# Altium schematic sheet Controle.SchDoc
size A4; Engineer: Kayann Soares; SheetNumber: 2; SheetTotal: 11; CompanyInfo1: Universidade Federal do Ceará; CompanyInfo2: Centro de Tecnologia - CT; CompanyInfo3: Dep. de Eng. de Teleinformática
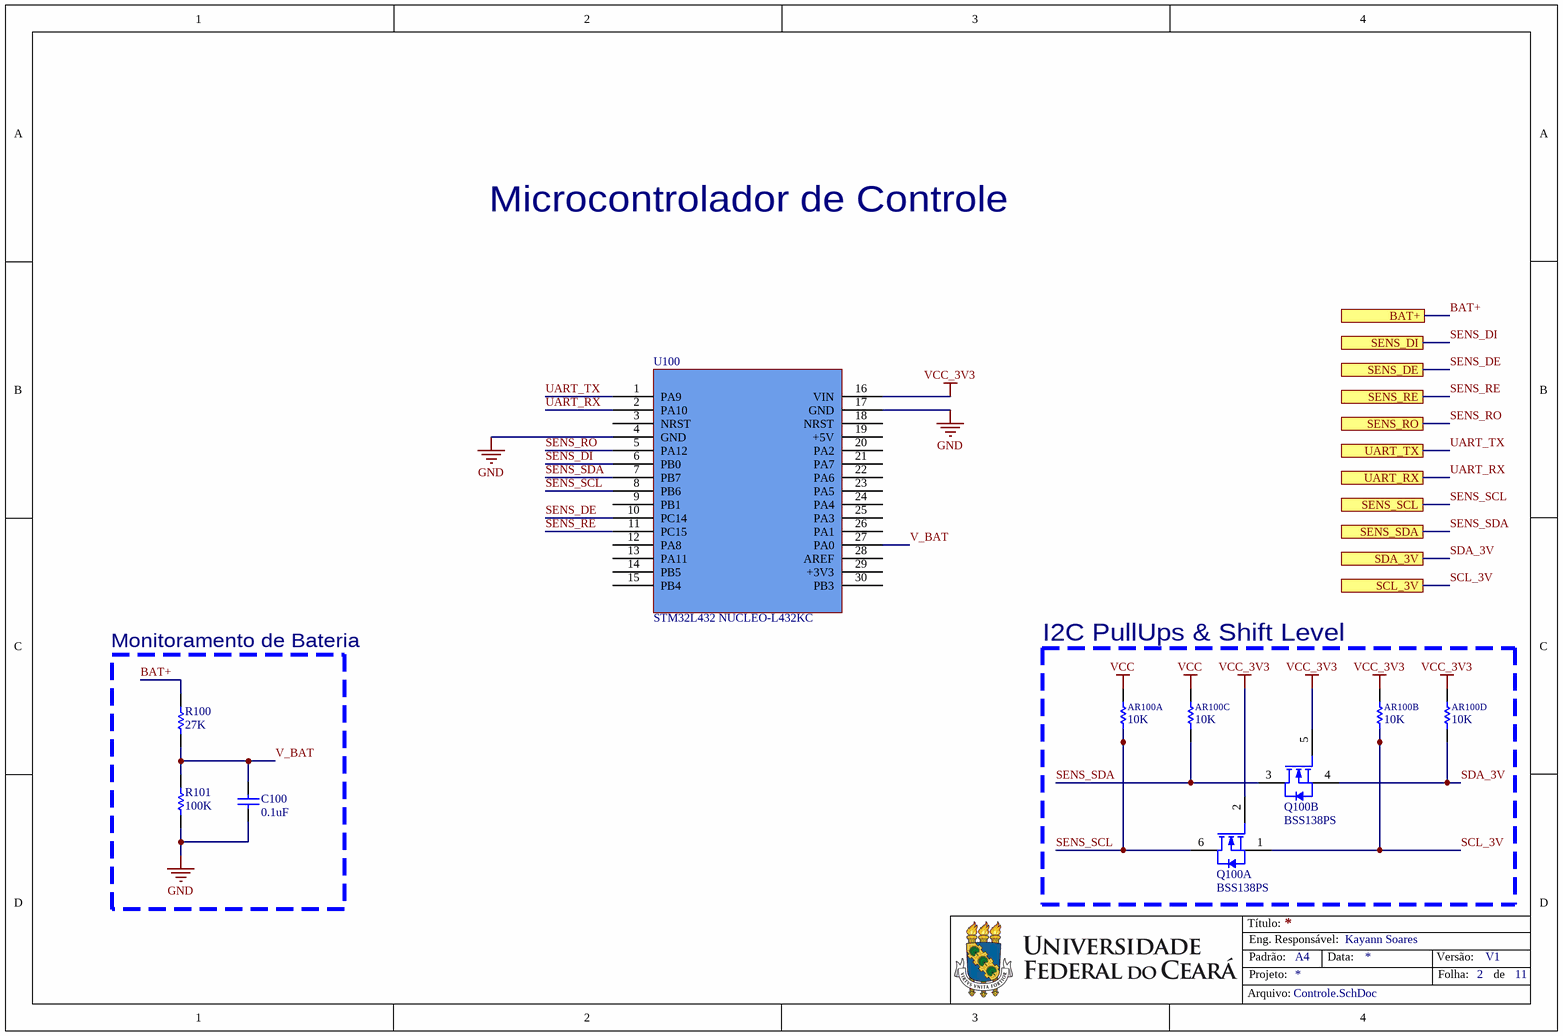
[diagram p0: Controle.SchDoc]

## Parts
AR100  10K  [RES_ARRAY _4RES_1206]  (parts A,B,C,D of 4)
C100  0.1uF  [CAP_CER_0603]
Q100  BSS138PS  [BSS138PS]  (parts A,B of 2)
R100  27K  [RES_0603]
R101  100K  [RES_0603]
U100  STM32L432 NUCLEO-L432KC  [STM32L432]

## Blocks framed on the sheet
Monitoramento de Bateria: C100 R100 R101
I2C PullUps & Shift Level: AR100 Q100

## Ports
BAT+, SCL_3V, SDA_3V, SENS_DE, SENS_DI, SENS_RE, SENS_RO, SENS_SCL, SENS_SDA, UART_RX, UART_TX

## Nets
GND: C100.1 R101.1 U100.4(GND) U100.17(GND)
VCC: AR100.6 AR100.8
VCC_3V3: AR100.5 AR100.7 Q100.2(G1) Q100.5(G2) U100.16(VIN)
BAT+: R100.2 ; port BAT+
SCL_3V: AR100.2 Q100.1(S1) ; port SCL_3V
SDA_3V: AR100.4 Q100.4(S2) ; port SDA_3V
SENS_DE: U100.10(PC14) ; port SENS_DE
SENS_DI: U100.6(PB0) ; port SENS_DI
SENS_RE: U100.11(PC15) ; port SENS_RE
SENS_RO: U100.5(PA12) ; port SENS_RO
SENS_SCL: AR100.1 Q100.6(D1) U100.8(PB6) ; port SENS_SCL
SENS_SDA: AR100.3 Q100.3(D2) U100.7(PB7) ; port SENS_SDA
UART_RX: U100.2(PA10) ; port UART_RX
UART_TX: U100.1(PA9) ; port UART_TX
V_BAT: C100.2 R100.1 R101.2 U100.27(PA0)

Not connected (* = marked no-connect by the designer): U100 3(NRST) 9(PB1) 12(PA8) 13(PA11) 14(PB5) 15(PB4) 18(NRST) 19(+5V) 20(PA2) 21(PA7) 22(PA6) 23(PA5) 24(PA4) 25(PA3) 26(PA1) 28(AREF) 29(+3V3) 30(PB3)

## Notes on the sheet
- Microcontrolador de Controle
- Título:
- Padrão:
- Projeto:
- Eng. Responsável:
- A4
- Data:
- Versão:
- Folha:
- V1
- de
- Arquivo:

## Library data of the parts
AR100 = RES_ARRAY_10K_1206: Supplier 1: Arrow Electronics; Supplier Part Number 1: CAY16-103J4LF
C100 = CAP_CER_0.1uF_0603: Supplier 1: Digi-Key Marketplace; Supplier Part Number 1: 2571-GMC10X7R104J25NTTR-ND
R100 = RES_27K_0603: Supplier 1: Future Electronics; Supplier Part Number 1: 6067715
R101 = RES_100K_0603: Supplier 1: Future Electronics; Supplier Part Number 1: 3697448
U100 = STM32L432
Q100 = BSS138PS: Supplier 1: Arrow Electronics; Supplier Part Number 1: BSS138PS,115